# EAGLE design DreamPSURev2-0 (EAGLE 8.4.3)
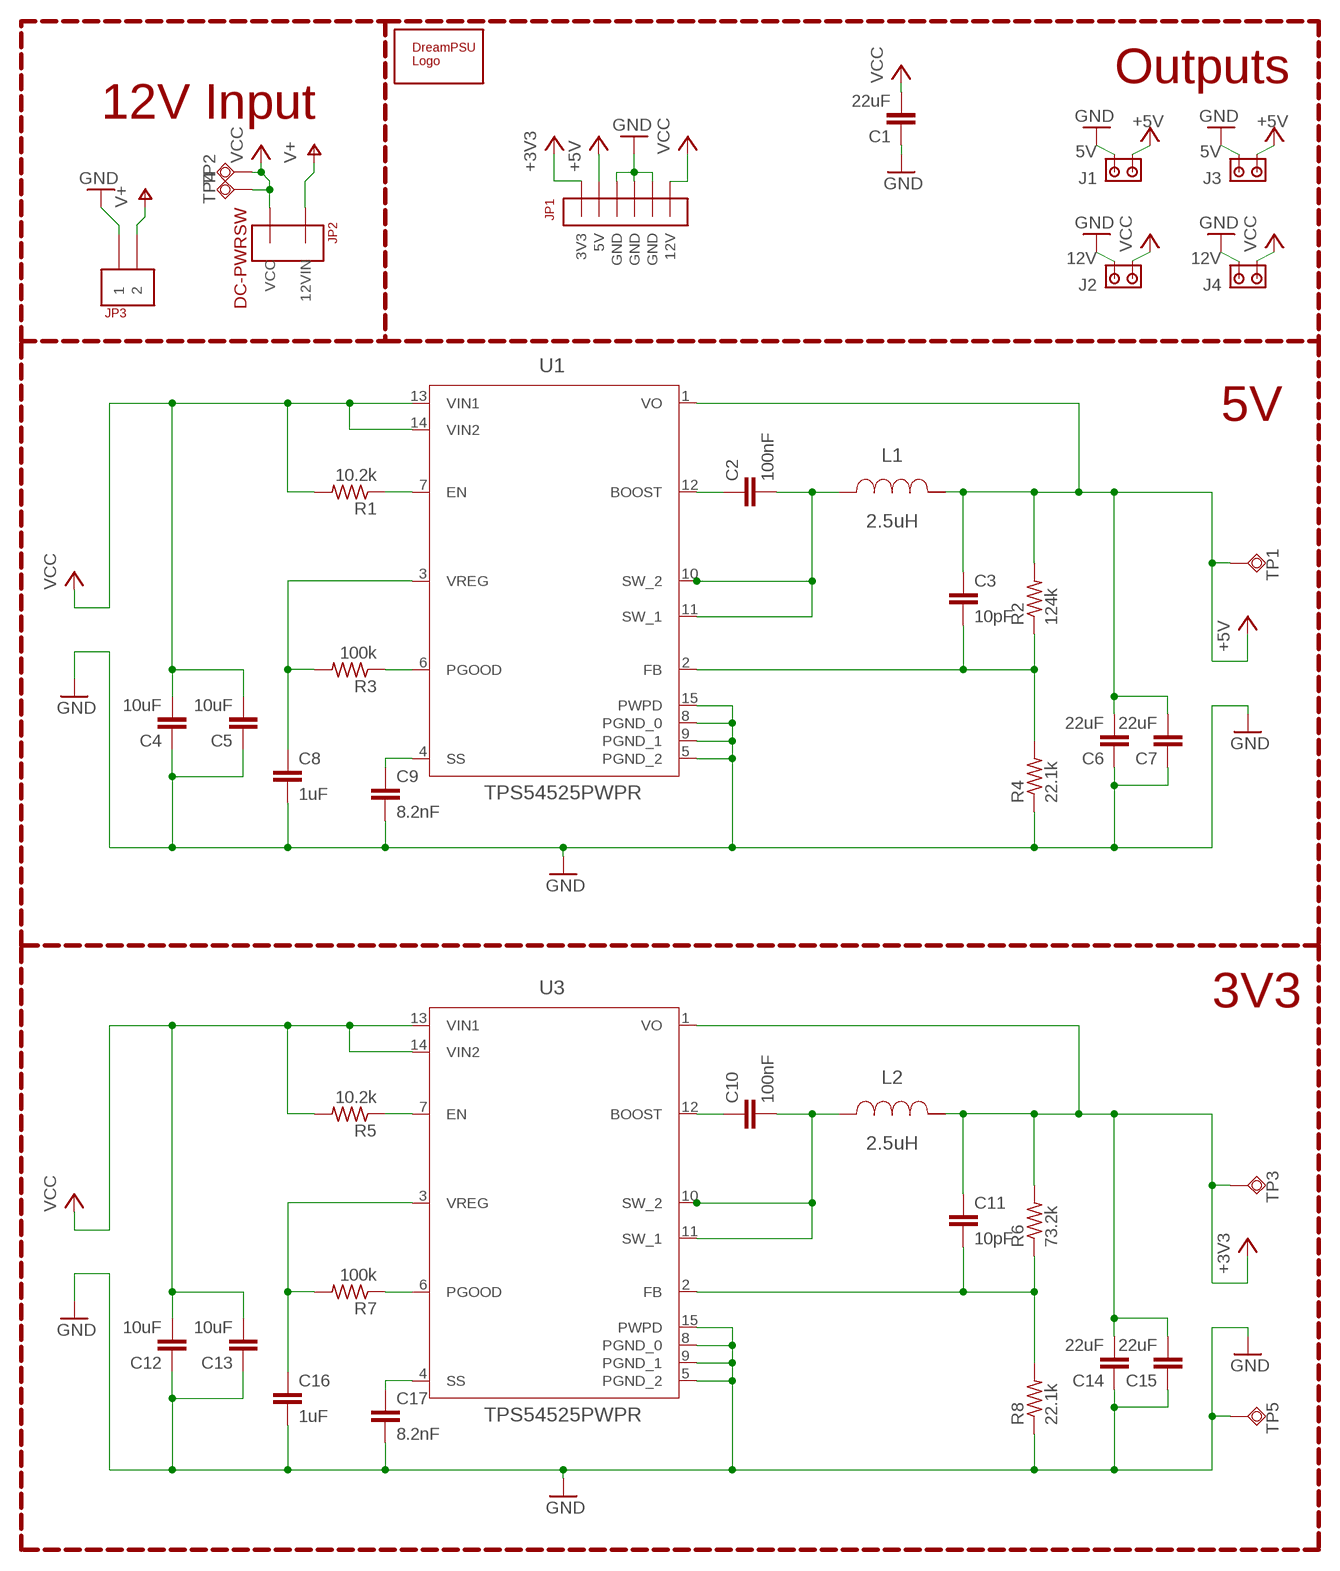
[diagram p0: schematic, sheet 1]

## Parts
C1  22uF  CAPACITORC0805  [C0805]
C2  100nF  CAPACITORC0603  [C0603]
C3  10pF  CAPACITORC0603  [C0603]
C4  10uF  CAPACITORC1206  [C1206]
C5  10uF  CAPACITORC1206  [C1206]
C6  22uF  CAPACITORC0805  [C0805]
C7  22uF  CAPACITORC0805  [C0805]
C8  1uF  CAPACITORC0603  [C0603]
C9  8.2nF  CAPACITORC0603  [C0603]
C10  100nF  CAPACITORC0603  [C0603]
C11  10pF  CAPACITORC0603  [C0603]
C12  10uF  CAPACITORC1206  [C1206]
C13  10uF  CAPACITORC1206  [C1206]
C14  22uF  CAPACITORC0805  [C0805]
C15  22uF  CAPACITORC0805  [C0805]
C16  1uF  CAPACITORC0603  [C0603]
C17  8.2nF  CAPACITORC0603  [C0603]
J1  5V  PWRHEADER-MTA02-100  [10X02MTA]
J2  12V  PWRHEADER-MTA02-100  [10X02MTA]
J3  5V  PWRHEADER-MTA02-100  [10X02MTA]
J4  12V  PWRHEADER-MTA02-100  [10X02MTA]
JP1  09-48-3064  MOLEX-6PIN-09-62-3062  [09-62-3062]
JP2  DC-PWRSW  DC-POWERSWITCH-1-1123724-2  [1-1123724-2]
JP3  640445-2_3.96MM-2PIN-HEADER  [640445-2_3.96MM-2PIN-HEADER]
L1  2.5uH  PA4341.252NLT  [PA4341.252NLT]
L2  2.5uH  PA4341.252NLT  [PA4341.252NLT]
R1  10.2k  R-US_R0603  [R0603]
R2  124k  R-US_R0603  [R0603]
R3  100k  R-US_R0603  [R0603]
R4  22.1k  R-US_R0603  [R0603]
R5  10.2k  R-US_R0603  [R0603]
R6  73.2k  R-US_R0603  [R0603]
R7  100k  R-US_R0603  [R0603]
R8  22.1k  R-US_R0603  [R0603]
TP1  TPSQB1,27  [B1,27]
TP2  TPSQB1,27  [B1,27]
TP3  TPSQB1,27  [B1,27]
TP4  TPSQB1,27  [B1,27]
TP5  TPSQB1,27  [B1,27]
U1  TPS54525PWPR  TPS54625PWPR  [R-PDSO-G14]
U3  TPS54525PWPR  TPS54625PWPR  [R-PDSO-G14]
U$3  DREAMPSU  [DREAMPSU]

## Nets
2: C2.2 L1.P$1 U1.10(SW_2) U1.11(SW_1)
18: C10.2 L2.P$1 U3.10(SW_2) U3.11(SW_1)
+3V3: C11.1 C14.2 C15.2 JP1.3V3 L2.P$2 R6.2 TP3.TP U3.1(VO)
+5V: C3.1 C6.2 C7.2 J1.POWER J3.POWER JP1.5V L1.P$2 R2.2 TP1.TP U1.1(VO)
GND: C1.1 C4.1 C5.1 C6.1 C7.1 C8.2 C9.2 C12.1 C13.1 C14.1 C15.1 C16.2 C17.2 J1.GND J2.GND J3.GND J4.GND JP1.GND@0(GND) JP1.GND@1(GND) JP1.GND@2(GND) JP3.P$1 R4.1 R8.1 TP5.TP U1.5(PGND_2) U1.8(PGND_0) U1.9(PGND_1) U1.15(PWPD) U3.5(PGND_2) U3.8(PGND_0) U3.9(PGND_1) U3.15(PWPD)
N$1: R1.1 U1.7(EN)
N$2: C8.1 R3.2 U1.3(VREG)
N$3: R5.1 U3.7(EN)
N$4: C10.1 U3.12(BOOST)
N$5: R3.1 U1.6(PGOOD)
N$6: C9.1 U1.4(SS)
N$7: C16.1 R7.2 U3.3(VREG)
N$8: R7.1 U3.6(PGOOD)
N$9: C17.1 U3.4(SS)
N$10: C11.2 R6.1 R8.2 U3.2(FB)
N$11: C3.2 R2.1 R4.2 U1.2(FB)
N$12: C2.1 U1.12(BOOST)
V+: JP2.12VIN JP3.P$2
VCC: C1.2 C4.2 C5.2 C12.2 C13.2 J2.POWER J4.POWER JP1.12V JP2.VCC R1.2 R5.2 TP2.TP TP4.TP U1.13(VIN1) U1.14(VIN2) U3.13(VIN1) U3.14(VIN2)

## Notes on the sheet
- Outputs
- 12V Input
- 5V
- 3V3

## Library data of the parts
C1-C17 = DreamPSURev1-9:CAPACITOR: CAPACITOR, European symbol
J1-J4 = DreamPSURev1-9:PWRHEADER-MTA02-100: AMP connector
JP1 = DreamPSURev1-9:MOLEX-6PIN-09-62-3062
JP2 = SaturnPSU_1.5:DC-POWERSWITCH-1-1123724-2
JP3 = SaturnPSU_1.5:640445-2_3.96MM-2PIN-HEADER
L1 L2 = SaturnPSU_1.5:PA4341.252NLT
R1-R8 = DreamPSURev1-9:R-US_: RESISTOR, American symbol
TP1-TP5 = DreamPSURev1-9:TPSQ: Test pad
U1 U3 = DreamPSURev1-9:TPS54625PWPR; DATASHEETURL: http://www.ti.com/product/tps54225; FREQUENCY: 700000.0; IMAX: 2.0; MANUFACTURER_NAME: Texas Instruments; MANUFACTURER_PART_NUMBER: TPS54225PWP; MKTG_PACKAGE: R-PDSO-G14; NSID: TPS54225PWPR; PACKAGE: R-PDSO-G14; VENDOR: Texas Instruments
U$3 = DreamPSURev1-9:DREAMPSU

## Board
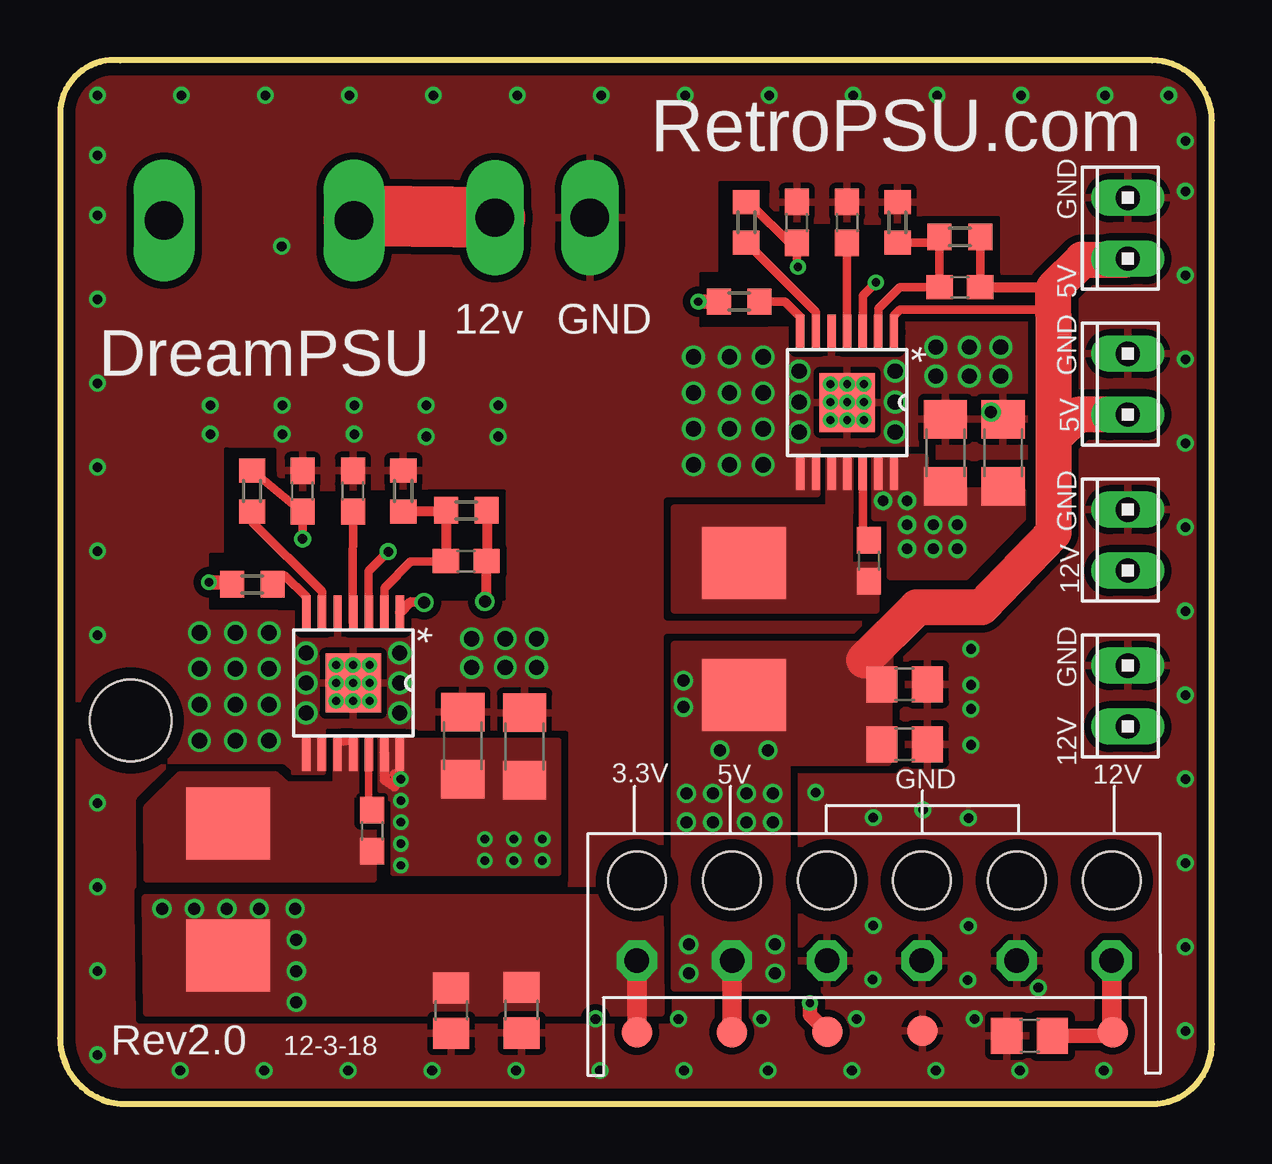
[diagram p1: board, top side]
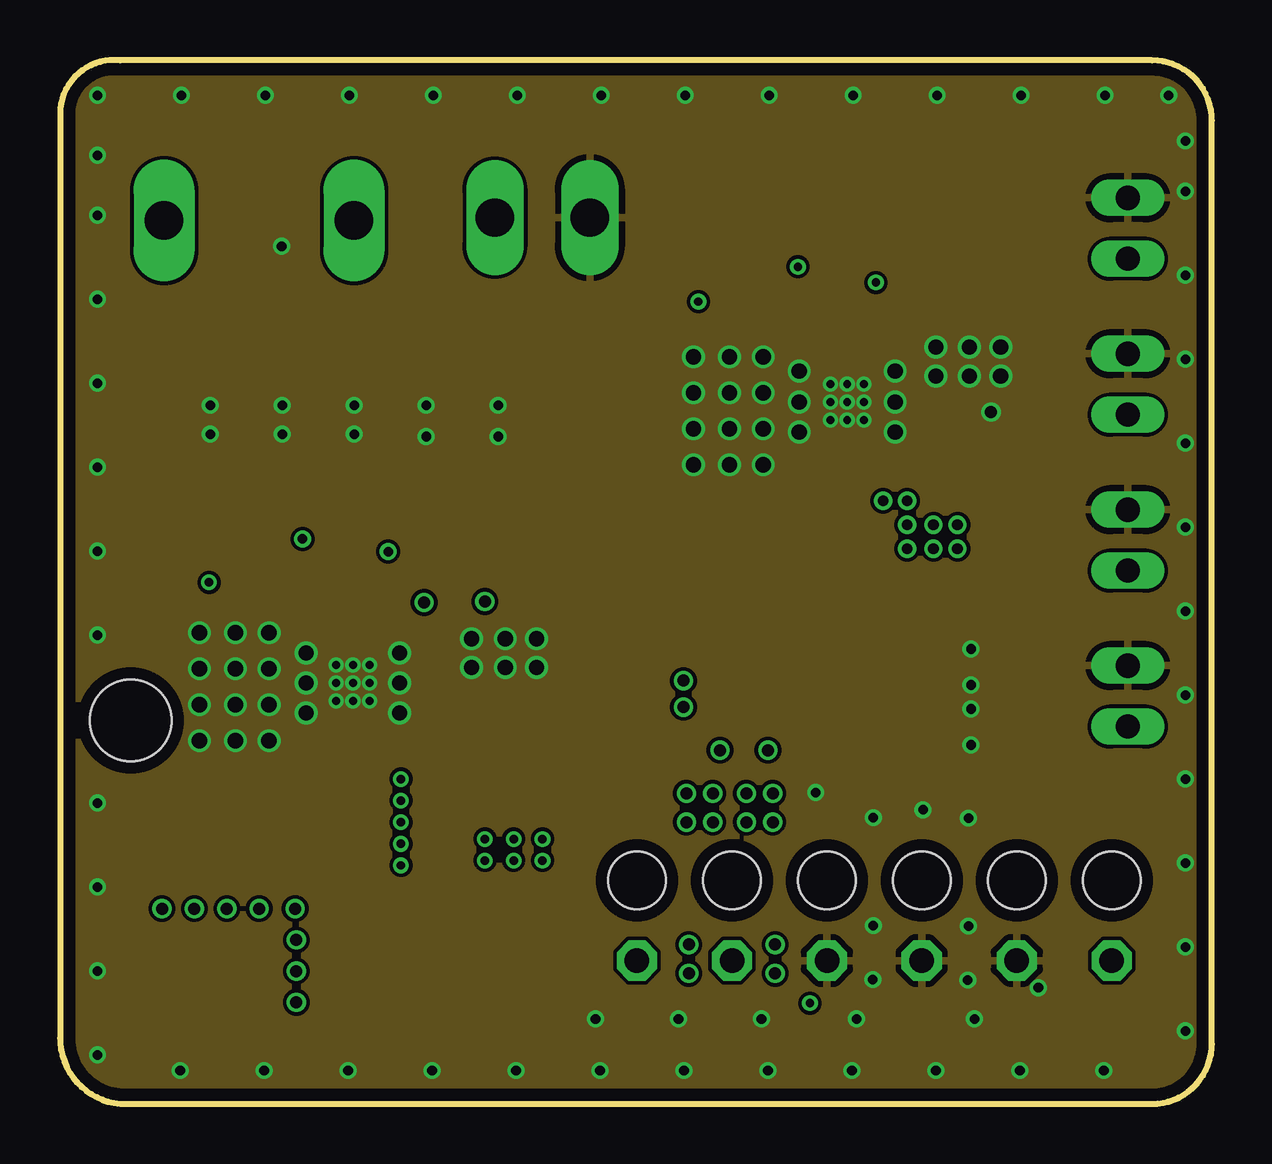
[diagram p2: board, inner layer GND]
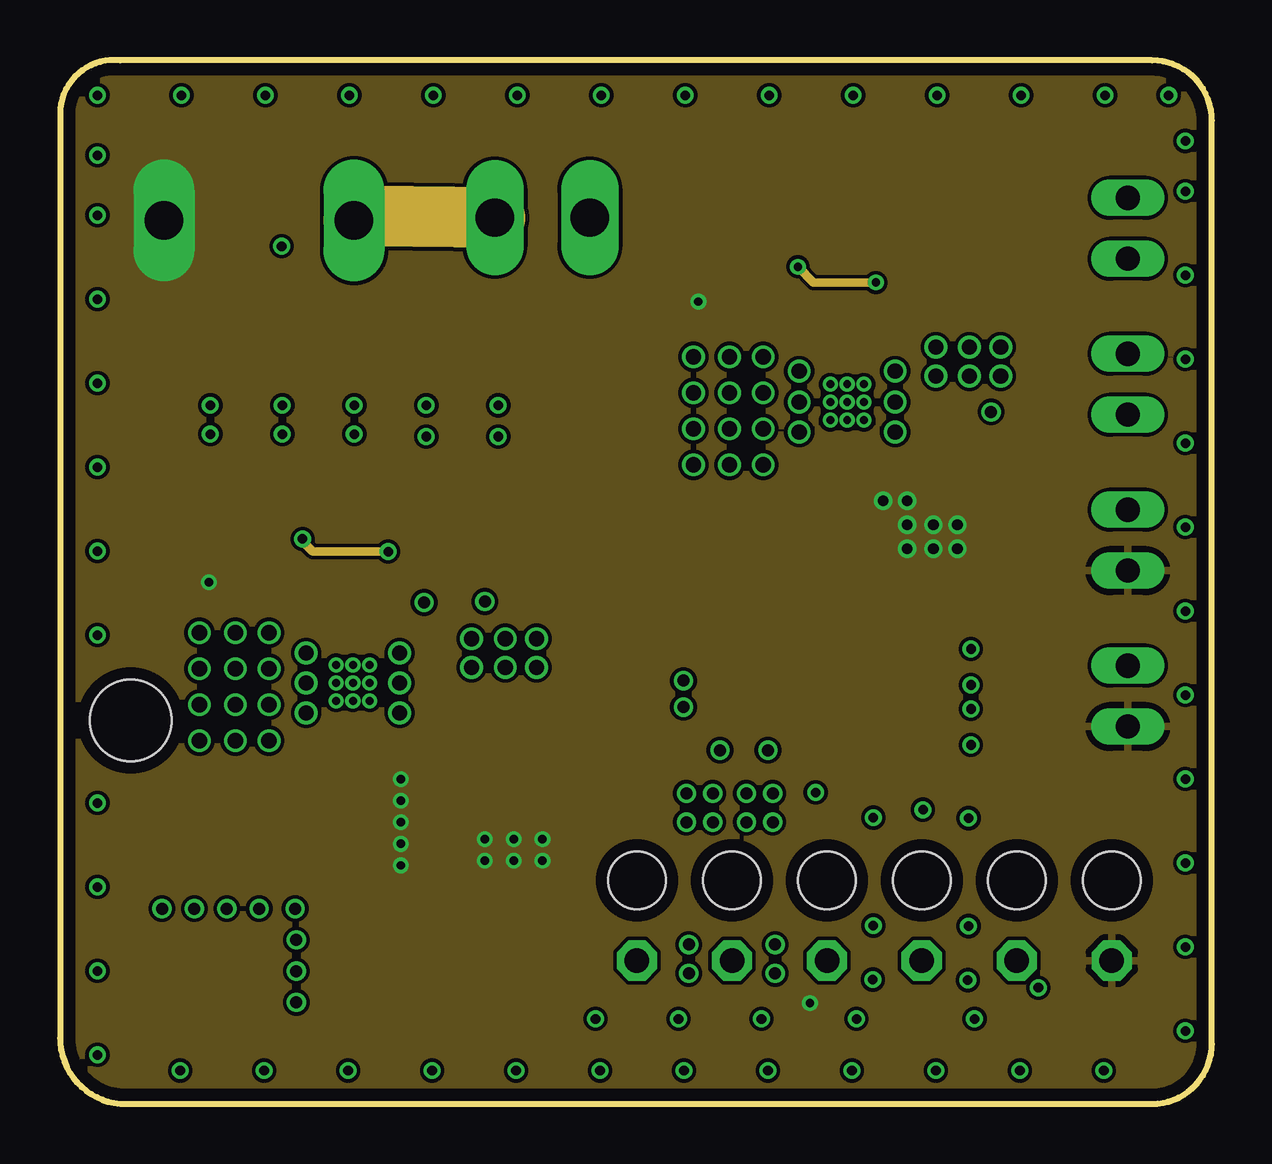
[diagram p3: board, inner layer VCC]
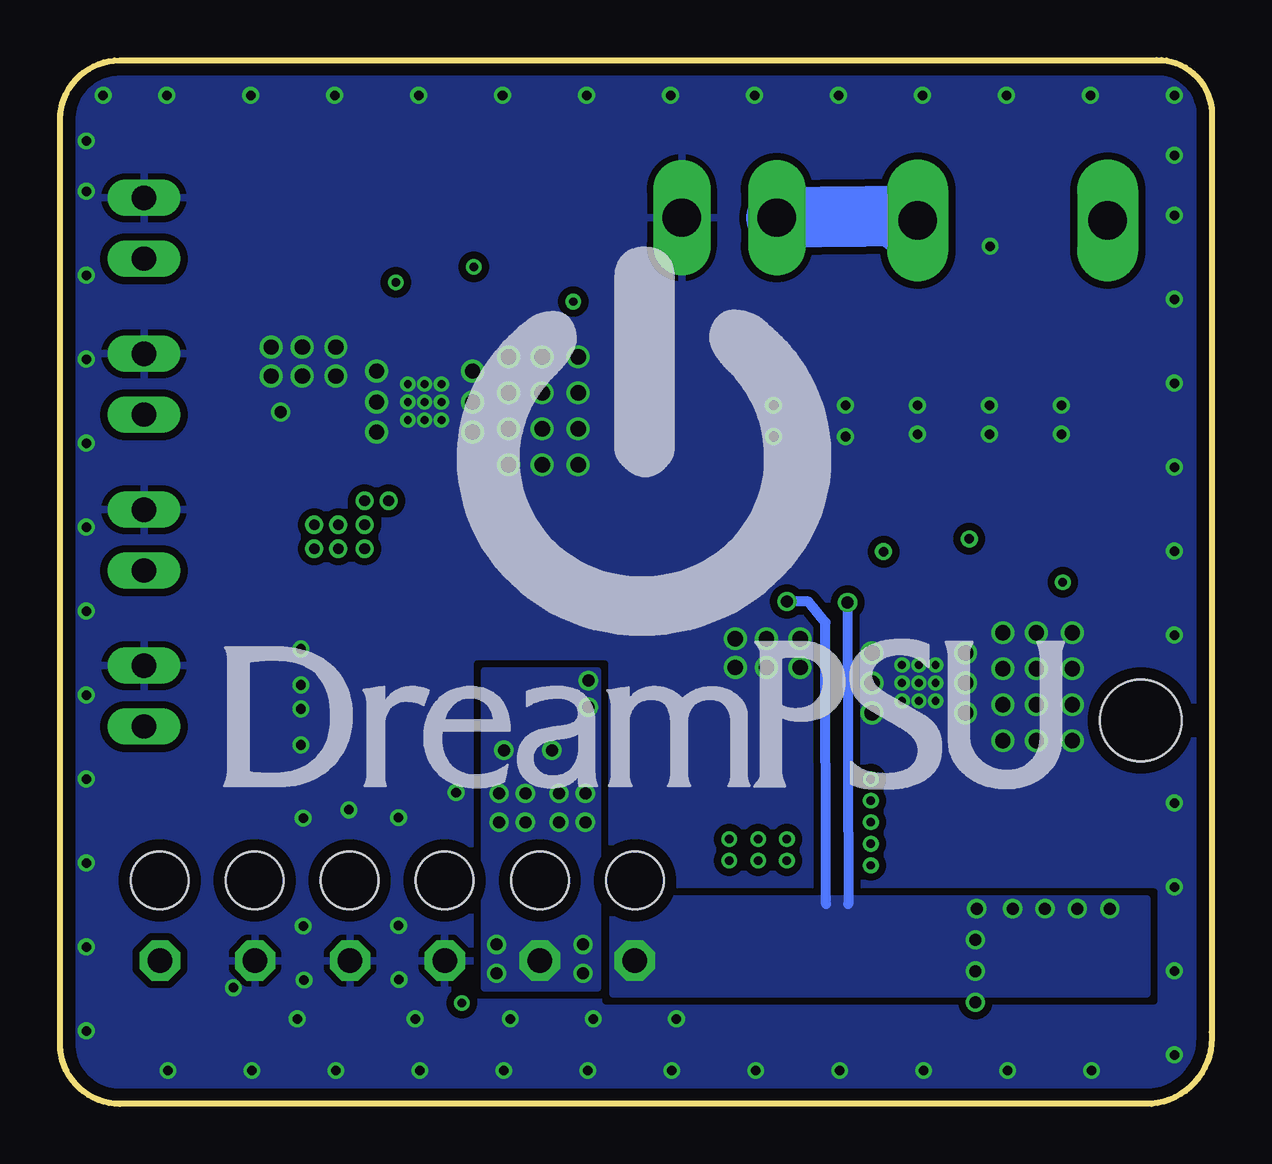
[diagram p4: board, bottom side, seen from below]

Size 48.01 x 43.51 mm. Coordinates in mm from the lower left corner, seen from the top.
Outline: 0.01,3 arc90 2.51,0 45.51,0 arc90 48.01,2.5 48.01,41 arc90 45.51,43.5 2.51,43.5 arc90 0.01,41.5 0.01,3
Copper layers (1*2*15*16): Top 0.035mm / dielectric 0.2mm / GND 0.035mm / dielectric 1.2mm / VCC 0.035mm / dielectric 0.2mm / Bottom 0.035mm
Design rules "Elecrow_4-layer_PCB_eagle_rule": minimum track width 6mil, minimum drill 12mil, track to track 6mil, track to pad 6mil, pad to pad 6mil, via to via 8mil, smd to smd 0mil, copper to edge 20mil, drill to drill 10mil, minimum pad ring 6mil, minimum via ring 6mil, stop-mask expansion 0mil, vias tented up to drill 100mil, thermal gap 10mil
Holes 3.4 mm at 2.95,15.98

### Footprints (pad centres in the part's own frame; a part is rotated, then mirrored left to right if it is on the bottom)
C0805 = smd 1.3 x 1.5: 1 -0.95,0; 2 0.95,0
C0603 = smd 1.1 x 1: 1 -0.85,0; 2 0.85,0
C1206 = smd 1.6 x 1.8: 1 -1.4,0; 2 1.4,0
10X02MTA = drill 1.016 long: GND 1.27,0; POWER -1.27,0
09-62-3062 = drill 1.02 pad 1.676 octagon: 3V3 -9.9,-3.35; 5V -5.94,-3.35; 12V 9.89,-3.35; GND@0 -1.98,-3.35; GND@1 1.97,-3.35; GND@2 5.93,-3.35 | hole 2.4: -9.9,0; -5.94,0; -1.98,0; 1.98,0; 5.94,0; 9.9,0
1-1123724-2 = drill 1.6 pad 2.54 long: 12VIN -3.96,0; VCC 3.96,0
640445-2_3.96MM-2PIN-HEADER = drill 1.6 long: P$1 -1.98,0; P$2 1.98,0
PA4341.252NLT = smd 3.5 x 3: P$1 0,2.5; P$2 0,-3
R0603 = smd 1 x 1.1: 1 -0.85,0; 2 0.85,0
B1,27 = smd 1.27 x 1.27: TP 0,0
R-PDSO-G14 = smd 1.461 x 0.351: 1 -2.925,1.95; 2 -2.925,1.3; 3 -2.925,0.65; 4 -2.925,0; 5 -2.925,-0.65; 6 -2.925,-1.3; 7 -2.925,-1.95; 8 2.925,-1.95; 9 2.925,-1.3; 10 2.925,-0.65; 11 2.925,0; 12 2.925,0.65; 13 2.925,1.3; 14 2.925,1.95 | smd 2.46 x 2.31: 15 0,0

### Placement (x,y rotation side)
C1  40.41,2.84 0 top
C2  33.71,22.64 270 top
C3  37.51,34.04 180 top
C4  39.31,27.14 270 top
C5  36.91,27.14 270 top
C6  35.21,14.99 180 top
C7  35.21,17.49 180 top
C8  30.71,36.74 90 top
C9  32.81,36.74 90 top
C10  13.02,11.38 270 top
C11  16.93,22.62 180 top
C12  19.36,14.9 270 top
C13  16.79,14.93 270 top
C14  19.24,3.9 90 top
C15  16.31,3.89 90 top
C16  10.11,25.54 90 top
C17  12.21,25.54 90 top
J1  44.51,30 90 top
J2  44.51,23.5 90 top
J3  44.51,36.5 90 top
J4  44.51,17 90 top
JP1  33.95,9.32 0 top
JP2  8.3,36.82 180 top
JP3  20.11,36.94 180 top
L1  28.51,20.04 0 top
L2  7.01,9.2 0 top
R1  28.31,33.44 180 top
R2  37.51,36.14 0 top
R3  28.61,36.74 90 top
R4  34.91,36.74 270 top
R5  8.02,21.66 180 top
R6  16.94,24.74 0 top
R7  8.01,25.54 90 top
R8  14.31,25.54 270 top
TP1  28,2.99 0 top
TP2  31.98,3 0 top
TP3  24.05,2.98 0 top
TP4  43.88,2.99 0 top
TP5  35.94,3.05 0 top
U1  32.81,29.24 270 top
U3  12.22,17.54 270 top
U$3  23.66,20.63 0 bottom

### Tracks (layer width: path | path; a pad name or v marks a point on that pad's centre or on a via)
2
  pour Top (no thermals): 32.91,24.84 25.61,24.84 25.61,20.59 34.01,20.59 34.01,22.44 32.91,22.44
  pour Top (no thermals): 32.01,27 32.96,27 32.96,24.6 32.01,24.6
18
  Top 0.406: 12.11,15.14 11.8,15.14
  pour Top (isolate 0.254, no thermals): 3.58,9.34 13.11,9.34 13.11,11.5 12.51,11.5 12.54,13.34 9.46,13.34 9.01,13.75 4.96,13.75 3.56,12.35
  pour Top (no thermals): 11.46,12.85 11.46,15.25 12.36,15.25 12.36,12.85
+3V3  (via drill 0.5)
  Top 0.406: U3.1 14.62,20.91 v15.18,20.9 | R6.2 17.82,25 17.82,22.99 C11.1 17.78,21.01 v17.71,20.94
  Top 0.813: TP3.TP JP1.3V3
  Bottom 0.406: 15.15,8.33 15.18,20.32 v15.18,20.9 | 16.08,8.34 16.1,20.07 16.81,20.94 v17.71,20.94
  other vias: 4.25,8.13 5.6,8.13 6.95,8.13 8.3,8.13 9.8,8.13 9.85,6.83 9.85,5.53 9.85,4.23
  pour Top (isolate 0.254, no thermals): 3.56,8.59 3.61,3.79 25.06,3.79 25.01,8.59
  pour Bottom (no thermals): 2.71,8.54 2.71,4.59 24.96,4.59 24.96,8.54
+5V  (via drill 0.5)
  Top 0.35: R2.2 C3.1 | U1.1 34.76,32.85 35.01,33.1 41.14,33.1 41.41,32.82
  Top 0.406: 41.41,34 arc90 41.37,34.04 C3.1 | 41.33,32.74 arc90 41.41,32.82
  Top 0.61: C7.2 33.51,18.24 33.51,18.5
  Top 0.813: TP1.TP JP1.5V
  Top 1.5: 41.41,27.72 41.41,23.8 38.41,20.7 35.71,20.7 33.51,18.5 | 41.41,27.72 41.41,32.82 41.41,34 42.61,35.2 44.48,35.2 J3.POWER | J1.POWER 42.42,28.73 41.41,27.72
  other vias: 26.11,12.94 27.21,12.94 28.61,12.94 29.71,12.94 25.99,16.54 27.51,14.74 29.51,14.74 25.99,17.64 26.11,11.74 27.21,11.74 28.61,11.74 29.71,11.74 29.81,6.64 29.81,5.44 26.21,6.64 26.21,5.44
  pour Top (no thermals): 25.61,19.14 34.61,19.14 34.51,14.24 30.31,14.24 30.31,4.84 25.61,4.84
  pour Bottom (no thermals): 30.31,4.84 30.31,18.04 25.61,18.04 25.61,4.84
GND  (via drill 0.33, 0.4, 0.5, 0.64)
  other vias: 12.91,18.3 33.9,7.43 37.87,7.41 6.27,29.12 9.27,29.12 12.27,29.12 15.27,29.12 18.27,29.12 33.88,5.18 37.84,5.16 9.24,35.75 6.27,27.92 9.27,27.92 12.27,27.92 15.27,27.82 18.27,27.82 33.9,11.93 37.87,11.91 35.97,12.26 31.5,12.98 11.51,18.3 11.51,16.8 12.91,16.8 5.81,19.64 7.31,19.64 8.71,19.64 36.51,31.54 37.91,31.54 39.21,31.54 36.51,30.34 37.91,30.34 39.21,30.34 38.81,28.84 30.81,30.55 30.81,28 30.81,29.25 5.81,18.14 7.31,18.14 8.71,18.14 5.81,16.64 7.31,16.64 8.71,16.64 5.81,15.14 7.31,15.14 8.71,15.14 1.56,2.04 22.32,3.54 25.78,3.54 29.24,3.54 33.2,3.54 38.12,3.54 40.78,4.84 46.91,3.04 10.26,17.54 10.26,18.79 10.26,16.29 37.97,18.96 37.97,17.46 37.97,16.46 37.97,14.96 34.81,30.55 34.81,28 34.81,29.25 26.41,31.14 27.91,31.14 29.31,31.14 26.41,29.64 27.91,29.64 29.31,29.64 26.41,28.14 27.91,28.14 29.31,28.14 26.41,26.64 27.91,26.64 29.31,26.64 17.16,19.39 18.56,19.39 19.86,19.39 17.16,18.19 18.56,18.19 19.86,18.19 46.91,6.54 46.91,10.04 46.91,13.54 46.91,17.04 46.91,20.54 46.91,24.04 46.91,27.54 46.91,31.04 46.91,34.54 46.91,38.04 1.56,5.54 1.56,9.04 1.56,12.54 1.56,19.54 1.56,23.04 1.56,26.54 1.56,30.04 1.56,33.54 1.56,37.04 1.56,42.04 5.01,1.39 8.51,1.39 12.01,1.39 15.51,1.39 19.01,1.39 22.51,1.39 26.01,1.39 29.51,1.39 33.01,1.39 36.51,1.39 40.01,1.39 43.51,1.39 5.06,42.04 8.56,42.04 12.06,42.04 15.56,42.04 19.06,42.04 22.56,42.04 26.06,42.04 29.56,42.04 33.06,42.04 36.56,42.04 40.06,42.04 43.56,42.04 46.21,42.04 12.21,17.55 11.51,17.55 12.91,17.55 12.21,18.3 12.21,16.8 14.16,17.54 14.16,18.79 14.16,16.29 33.51,30 32.11,30 32.11,28.5 33.51,28.5 32.81,29.25 32.11,29.25 33.51,29.25 32.81,30 32.81,28.5 1.56,39.54 46.91,40.14
  pour Bottom (isolate 0.305, rank 2): -0.57,44.94 48.58,44.06 48.54,-0.6 -0.57,-0.59
  pour Top (isolate 0.305, rank 2): -1.23,45.9 49.74,45.74 49.51,-1.5 -1.24,-1.66
  pour Top (no thermals): 30.51,25.44 30.51,27.54 31.56,27.54 31.56,25.44
  pour Top (no thermals): 9.71,13.81 10.99,13.81 10.99,15.94 9.71,15.94
  pour GND: -2.99,47.64 -2.99,-3.36 51.51,-3.36 51.51,47.64
N$1
  Top 0.35: U1.7 30.86,32.79 30.21,33.44 R1.1
N$2  (via drill 0.35)
  Top 0.305: C8.1 30.46,35.84
  Top 0.35: 28.46,37.49 R3.2 28.81,37.49 30.46,35.84 | 30.76,35.79 C8.1 30.71,34.94 v30.76,34.89 | U1.3 33.46,33.69 v34.01,34.24
  VCC 0.35: v30.76,34.89 31.41,34.24 v34.01,34.24
N$3
  Top 0.35: R5.1 8.84,22.02 9.37,22.02 10.27,21.12 U3.7
N$4
  Top 0.305: 12.87,12.09 U3.12
  Top 0.406: C10.1 12.87,12.09
N$5
  Top 0.35: U1.6 31.51,33 28.72,35.79 R3.1
N$6
  Top 0.35: U1.4 C9.1
N$7  (via drill 0.4)
  Top 0.35: v13.68,23.02 12.87,22.21 U3.3 | R7.2 9.73,24.97 10.1,24.97 10.11,24.96 v10.11,23.55
  Top 0.406: C16.1 10.1,24.97
  VCC 0.35: v13.68,23.02 10.53,23.02 10.11,23.44 v10.11,23.55
N$8
  Top 0.35: U3.6 10.92,21.35 8.01,24.26 R7.1
N$9
  Top 0.35: C17.1 12.21,23.5 12.2,22.85 12.2,20.09 U3.4
N$10
  Top 0.35: U3.2 13.52,21.51 14.62,22.61 16.37,22.61
  Top 0.406: 16.37,22.61 C11.2 | 16.11,22.89 16.11,24.92 | R6.1 15.94,24.69 R8.2
  Top 0.61: C11.2 16.11,22.89 | 16.11,24.92 R6.1
N$11
  Top 0.35: R4.2 36.31,35.89 R2.1 C3.2 35.01,34.04 34.11,33.14 U1.2
N$12
  Top 0.35: U1.12 33.46,23.74 C2.1
N$16
  cutout Top: 8.94,27.28 6.98,27.29 6.91,27.3 6.91,22.9 6.29,22.9 6.29,20.67 14.71,20.6 14.71,21.04 18.51,21.04 18.51,25.54 15.36,25.54 15.36,25.55 8.97,25.45
  cutout Top: 29.51,38.4 27.51,38.4 27.51,34.6 26.71,34.6 26.71,32.45 35.11,32.5 35.11,32.75 39.11,32.75 39.11,36.94 35.96,36.94 35.96,36.55 29.47,36.65
V+
  Top 2.54: JP3.P$2 12.91,37 JP2.12VIN
  VCC 2.54: JP3.P$2 13.01,37 JP2.12VIN
  Bottom 2.54: 12.61,37 JP3.P$2 | JP2.12VIN 12.81,36.64
VCC  (via drill 0.35, 0.45)
  Top 0.406: 13.94,13.23 13.55,13.49 13.52,14.05 U3.13 | 14.15,13.55 13.95,13.74
  Top 0.61: R5.2 6.95,21.74 v6.21,21.74 | R1.2 v26.61,33.44 | C1.2 43.83,2.84 TP4.TP | v31.26,4.2 31.26,3.72 TP2.TP
  Top 0.813: 43.76,5.89 JP1.12V 43.84,3.03 TP4.TP
  other vias: 17.71,11.04 14.21,11.74 14.21,13.54 14.21,10.84 14.21,12.64 14.21,9.94 18.91,11.04 20.11,11.04 17.71,10.14 18.91,10.14 20.11,10.14 34.31,25.14 35.31,25.14 35.31,24.14 35.31,23.14 36.41,23.14 36.41,24.14 37.41,23.14 37.41,24.14
  pour Top (no thermals): 20.81,15.14 13.36,15.14 13.38,12.89 13.86,12.66 13.86,9.62 20.81,9.62
  pour Top (no thermals): 13.34,15.24 14.51,15.24 14.51,13.06 13.34,13.06
  pour Top (no thermals): 33.96,26.94 33.96,24.44 34.61,24.44 34.61,21.99 37.76,21.99 40.01,24.3 40.11,24.4 40.11,25.54 36.06,25.54 36.06,26.94
  pour VCC: -1.99,46.74 -1.99,-2.36 50.51,-2.36 50.51,46.64

### Text on the board
tPlace: RetroPSU.com | DreamPSU | Rev2.0 | 12-3-18
tNames: 12v | GND